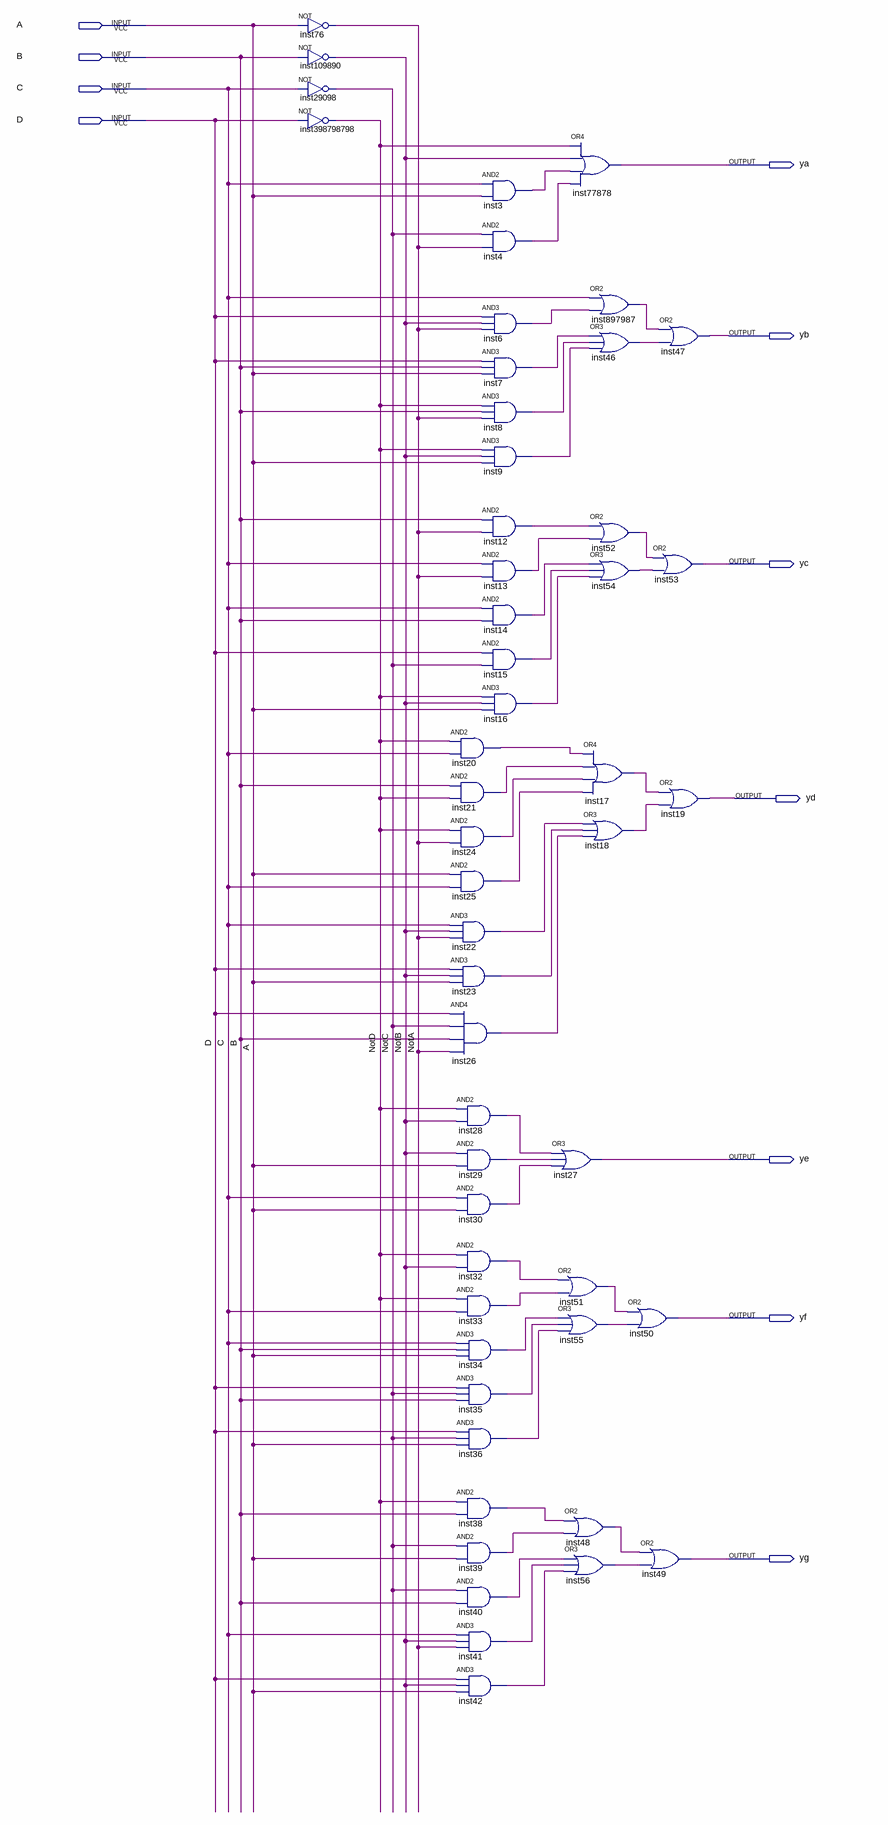
[diagram p0: schematic sheet]
// Quartus schematic BCD_LMDSH.bdf as structural Verilog: 52 symbols, 11 pins
module BCD_LMDSH (
  input  A,
  input  B,
  input  C,
  input  D,
  output ya,
  output yb,
  output yc,
  output yd,
  output ye,
  output yf,
  output yg
);

  wire inst3_out, inst4_out, inst6_out, inst7_out, inst8_out, inst9_out, inst12_out, inst13_out, inst14_out,
       inst15_out, inst16_out, inst17_out, inst18_out, inst20_out, inst21_out, inst22_out, inst23_out,
       inst24_out, inst25_out, inst26_out, inst28_out, inst29_out, inst30_out, inst32_out, inst33_out,
       inst34_out, inst35_out, inst36_out, inst38_out, inst39_out, inst40_out, inst41_out, inst42_out,
       inst46_out, inst48_out, inst51_out, inst52_out, inst54_out, inst55_out, inst56_out, inst897987_out,
       NotA, NotB, NotC, NotD;

  not inst76 (NotA, A);
  not inst109890 (NotB, B);
  not inst29098 (NotC, C);
  not inst398798798 (NotD, D);
  and inst3 (inst3_out, C, A);
  and inst4 (inst4_out, NotC, NotA);
  and inst6 (inst6_out, D, NotB, NotA);
  and inst7 (inst7_out, D, B, A);
  and inst8 (inst8_out, NotD, B, NotA);
  and inst9 (inst9_out, NotD, NotB, A);
  and inst12 (inst12_out, B, NotA);
  and inst13 (inst13_out, C, NotA);
  and inst14 (inst14_out, C, B);
  and inst15 (inst15_out, D, NotC);
  and inst16 (inst16_out, NotD, NotB, A);
  and inst20 (inst20_out, NotD, C);
  and inst21 (inst21_out, B, NotD);
  and inst24 (inst24_out, NotD, NotA);
  and inst25 (inst25_out, A, C);
  and inst22 (inst22_out, C, NotB, NotA);
  and inst23 (inst23_out, D, NotB, A);
  and inst26 (inst26_out, D, NotC, B, NotA);
  and inst28 (inst28_out, NotD, NotB);
  and inst29 (inst29_out, NotB, A);
  and inst30 (inst30_out, C, A);
  and inst32 (inst32_out, NotD, NotB);
  and inst33 (inst33_out, NotD, C);
  and inst34 (inst34_out, C, B, A);
  and inst35 (inst35_out, D, NotC, B);
  and inst36 (inst36_out, D, NotC, A);
  and inst38 (inst38_out, NotD, B);
  and inst39 (inst39_out, NotC, A);
  and inst40 (inst40_out, NotC, B);
  and inst41 (inst41_out, C, NotB, NotA);
  and inst42 (inst42_out, D, NotB, A);
  or inst77878 (ya, NotD, NotB, inst3_out, inst4_out);
  or inst897987 (inst897987_out, C, inst6_out);
  or inst46 (inst46_out, inst7_out, inst8_out, inst9_out);
  or inst52 (inst52_out, inst12_out, inst13_out);
  or inst54 (inst54_out, inst14_out, inst15_out, inst16_out);
  or inst17 (inst17_out, inst20_out, inst21_out, inst24_out, inst25_out);
  or inst18 (inst18_out, inst22_out, inst23_out, inst26_out);
  or inst27 (ye, inst28_out, inst29_out, inst30_out);
  or inst51 (inst51_out, inst32_out, inst33_out);
  or inst55 (inst55_out, inst34_out, inst35_out, inst36_out);
  or inst48 (inst48_out, inst38_out, inst39_out);
  or inst56 (inst56_out, inst40_out, inst41_out, inst42_out);
  or inst50 (yf, inst51_out, inst55_out);
  or inst49 (yg, inst48_out, inst56_out);
  or inst47 (yb, inst897987_out, inst46_out);
  or inst53 (yc, inst52_out, inst54_out);
  or inst19 (yd, inst17_out, inst18_out);
endmodule
